# EAGLE schematic MaTouch Lite ESP32-S3 SPI TFT with Touch 3.95'' ST7796 v1.0 (EAGLE 6.1)
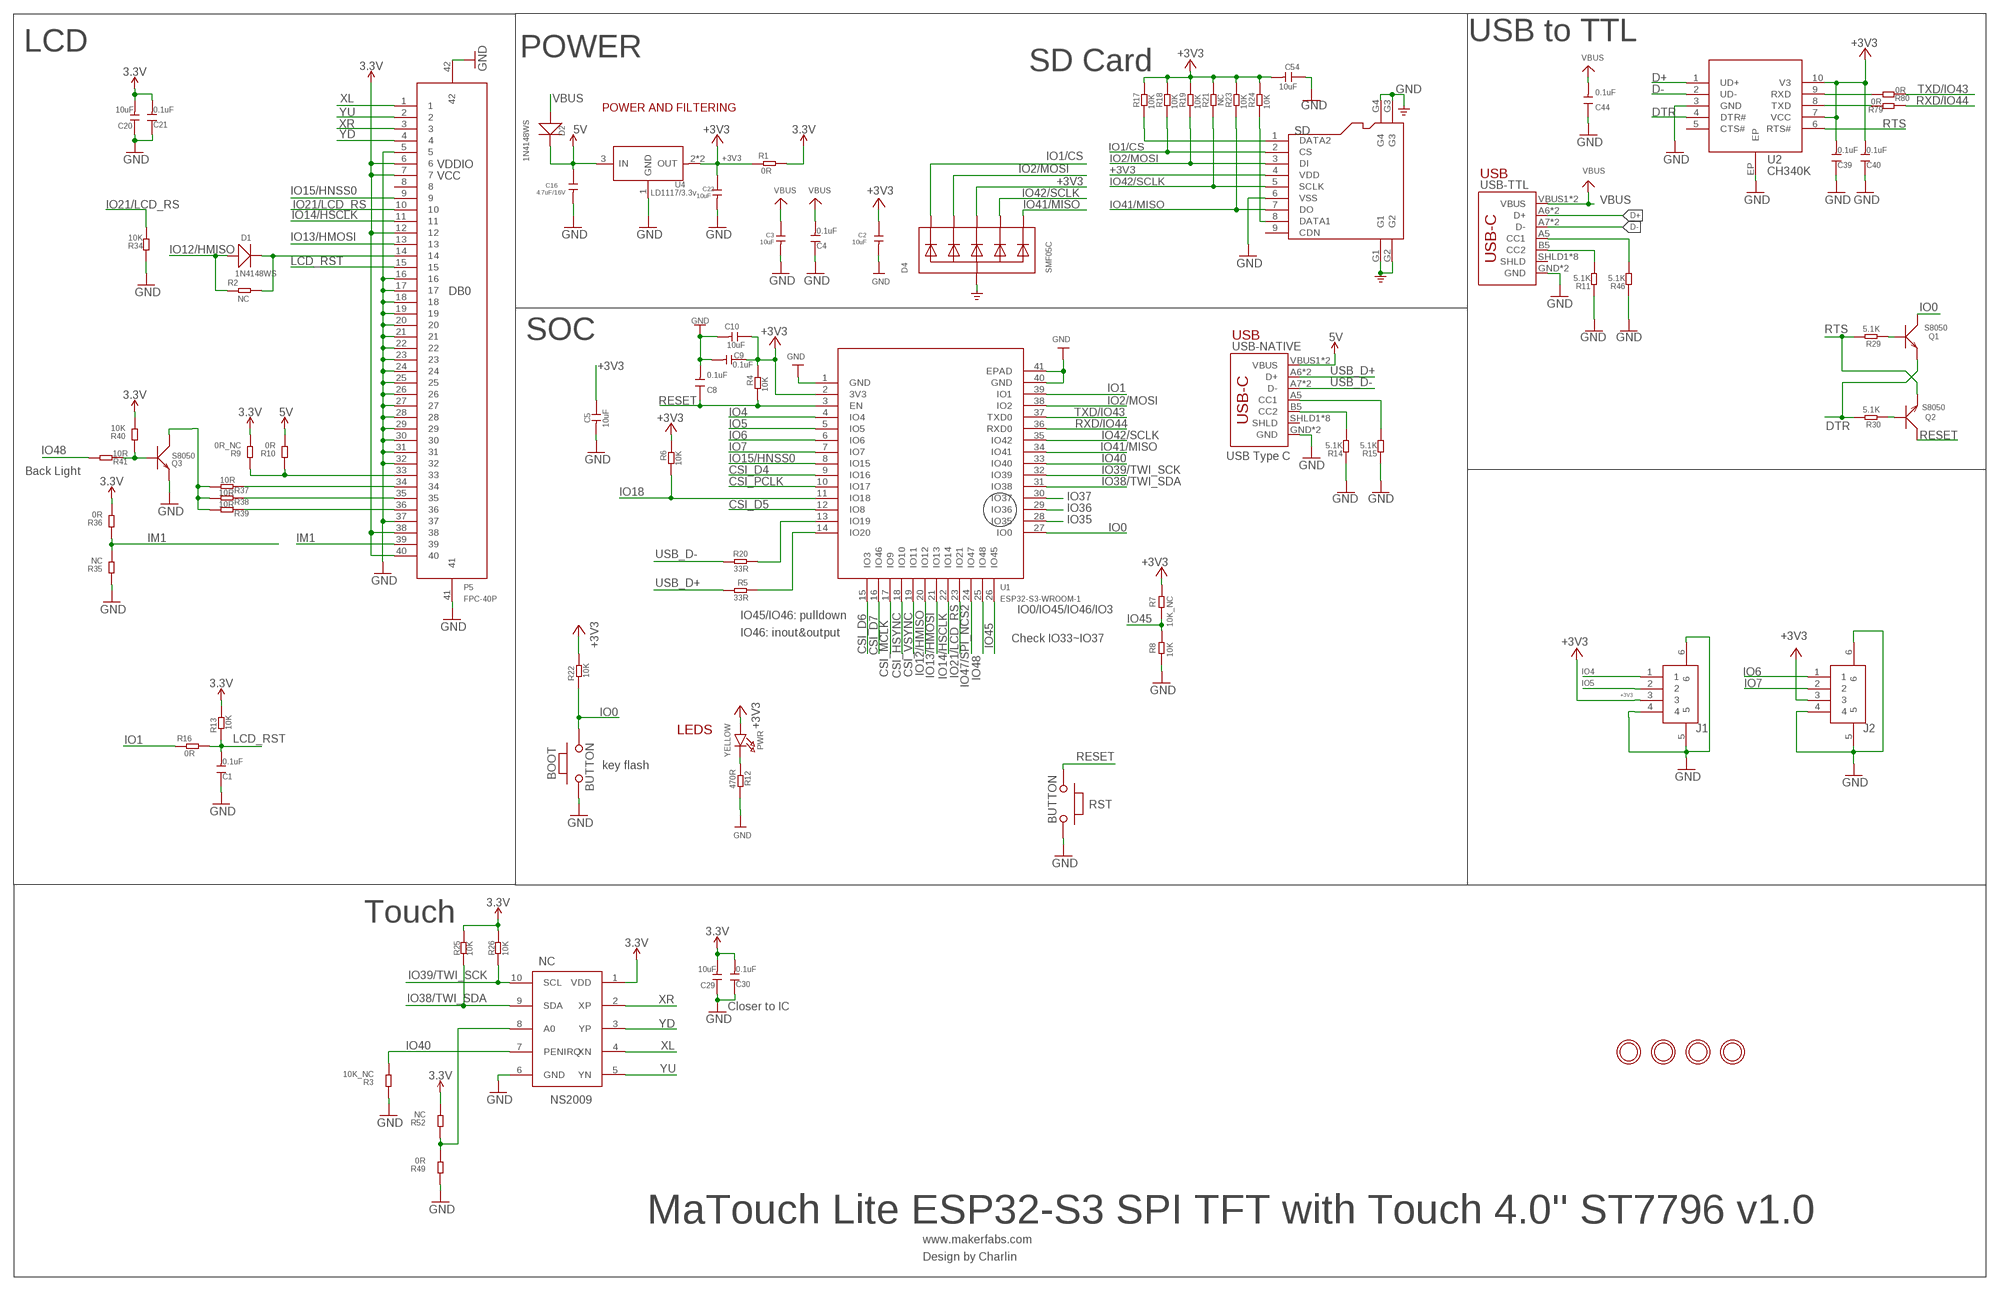
[diagram p0: schematic, sheet 1]

## Parts
BOOT  BUTTON  PB157  [157SW]
C1  0.1uF  DISCRETE_C-0603  [DISCRETE_C0603]
C2  10uF  C-0603  [0603]
C3  10uF  C-0603  [0603]
C4  0.1uF  DISCRETE_C-0603  [DISCRETE_C0603]
C5  10uF  DISCRETE_C-0603  [DISCRETE_C0603]
C8  0.1uF  DISCRETE_C-0603  [DISCRETE_C0603]
C9  0.1uF  DISCRETE_C-0603  [DISCRETE_C0603]
C10  10uF  DISCRETE_C-0603  [DISCRETE_C0603]
C16  4.7uF/16V  C-0603  [0603]
C20  10uF  DISCRETE_C-0603  [DISCRETE_C0603]
C21  0.1uF  DISCRETE_C-0603  [DISCRETE_C0603]
C22  10uF  C-0603  [0603]
C29  10uF  DISCRETE_C-0603  [DISCRETE_C0603]
C30  0.1uF  DISCRETE_C-0603  [DISCRETE_C0603]
C39  0.1uF  DISCRETE_C-0603  [DISCRETE_C0603]
C40  0.1uF  DISCRETE_C-0603  [DISCRETE_C0603]
C44  0.1uF  DISCRETE_C-0603  [DISCRETE_C0603]
C54  10uF  DISCRETE_C-0603  [DISCRETE_C0603]
D1  1N4148WS  D'0805'  [SOD323]
D2  1N4148WS  D'0805'  [SOD323]
D4  SMF05C  TVSARRAY_5LANE  [SOT363]
H1  MICROBUILDER_MOUNTINGHOLE3.0THIN  [MICROBUILDER_MOUNTINGHOLE_3.0_PLATEDTHIN]
H2  MICROBUILDER_MOUNTINGHOLE3.0THIN  [MICROBUILDER_MOUNTINGHOLE_3.0_PLATEDTHIN]
H3  MICROBUILDER_MOUNTINGHOLE3.0THIN  [MICROBUILDER_MOUNTINGHOLE_3.0_PLATEDTHIN]
H4  MICROBUILDER_MOUNTINGHOLE3.0THIN  [MICROBUILDER_MOUNTINGHOLE_3.0_PLATEDTHIN]
J1  CON4-1.25P-SMD  [SMD4-125P-1000L525W350H]
J2  CON4-1.25P-SMD  [SMD4-125P-1000L525W350H]
P5  FPC-40P  [SMD42-50P-2560L490W]
PWR  YELLOW  LED0805_NOOUTLINE  [CHIPLED_0805_NOOUTLINE]
Q1  S8050  TRANSISTOR-NPN-SOT23  [SOT23]
Q2  S8050  TRANSISTOR-NPN-SOT23  [SOT23]
Q3  S8050  TRANSISTOR-NPN-SOT23  [SOT23]
R1  0R  R-0603  [R0603]
R2  NC  R-0603  [R0603]
R3  10K_NC  DISCRETE_R-0603  [DISCRETE_R0603]
R4  10K  R-0603  [R0603]
R5  33R  R-0603  [R0603]
R6  10K  R-0603  [R0603]
R7  10K_NC  R-0603  [R0603]
R8  10K  R-0603  [R0603]
R9  0R_NC  DISCRETE_R-0603  [DISCRETE_R0603]
R10  0R  DISCRETE_R-0603  [DISCRETE_R0603]
R11  5.1K  DISCRETE_R-0603  [DISCRETE_R0603]
R12  470R  R-0603  [R0603]
R13  10K  R-0603  [R0603]
R14  5.1K  DISCRETE_R-0603  [DISCRETE_R0603]
R15  5.1K  DISCRETE_R-0603  [DISCRETE_R0603]
R16  0R  R-0603  [R0603]
R17  10K  R-0603  [R0603]
R18  10K  R-0603  [R0603]
R19  10K  R-0603  [R0603]
R20  33R  R-0603  [R0603]
R21  NC  R-0603  [R0603]
R22  10K  R-0603  [R0603]
R23  10K  R-0603  [R0603]
R24  10K  R-0603  [R0603]
R25  10K  R-0603  [R0603]
R26  10K  R-0603  [R0603]
R29  5.1K  R-0603  [R0603]
R30  5.1K  R-0603  [R0603]
R34  10K  DISCRETE_R-0603  [DISCRETE_R0603]
R35  NC  DISCRETE_R-0603  [DISCRETE_R0603]
R36  0R  DISCRETE_R-0603  [DISCRETE_R0603]
R37  10R  DISCRETE_R-0603  [DISCRETE_R0603]
R38  10R  DISCRETE_R-0603  [DISCRETE_R0603]
R39  10R  DISCRETE_R-0603  [DISCRETE_R0603]
R40  10K  DISCRETE_R-0603  [DISCRETE_R0603]
R41  10R  DISCRETE_R-0603  [DISCRETE_R0603]
R46  5.1K  DISCRETE_R-0603  [DISCRETE_R0603]
R49  0R  DISCRETE_R-0603  [DISCRETE_R0603]
R52  NC  DISCRETE_R-0603  [DISCRETE_R0603]
R79  0R  R-0603  [R0603]
R80  0R  R-0603  [R0603]
RST  BUTTON  PB157  [157SW]
SD  HOLDER-MICROSD-9P  [9P-SMD-W/-RING]
U1  ESP32-S3-WROOM-1  [ESP32-S3-WROOM-1]
U2  CH340K  [ESOP-10-EP-150MIL]
U4  LD1117/3.3v  LD1117'SOT89'  [SOT89]
U8  NS2009  [MSOP10]
USB-NATIVE  USB_C5  [USB-C-16P-5]
USB-TTL  USB_C5  [USB-C-16P-5]

## Nets
5V: C16.1 D2.- R10.2 U4.3(IN) USB-NATIVE.VBUS1(VBUS) USB-NATIVE.VBUS2(VBUS)
+3V3: C2.1 C5.1 C9.1 C10.1 C20.2 C21.2 C22.1 C29.2 C30.2 C39.2 C40.2 C54.2 D4.4(C3) J1.3 J2.3 P5.6 P5.7 P5.12 P5.38 P5.40 PWR.A R1.1 R1.2 R4.2 R6.2 R7.2 R9.2 R13.2 R17.2 R18.2 R19.2 R21.2 R22.2 R23.2 R24.2 R25.2 R26.2 R36.2 R40.2 R52.2 SD.4(VDD) U1.2(3V3) U2.7(VCC) U2.10(V3) U4.2(OUT) U4.4(OUT) U8.1(VDD) ; supply symbol labelled 3.3V
CSI_D4: U1.9(IO16)
CSI_D5: U1.12(IO8)
CSI_D6: U1.15(IO3)
CSI_D7: U1.16(IO46)
CSI_HSYNC: U1.18(IO10)
CSI_MCLK: U1.17(IO9)
CSI_PCLK: U1.10(IO17)
CSI_VSYNC: U1.19(IO11)
D+: U2.1(UD+) USB-TTL.A6(D+) USB-TTL.B6(D+)
D-: U2.2(UD-) USB-TTL.A7(D-) USB-TTL.B7(D-)
DTR: Q1.2(E) R30.2 U2.4(DTR#)
GND: BOOT.1 C1.1 C2.2 C3.2 C4.1 C5.2 C8.2 C9.2 C10.2 C16.2 C20.1 C21.1 C22.2 C29.1 C30.1 C39.1 C40.1 C44.1 C54.1 D4.2(A) J1.4 J1.5 J1.6 J2.4 J2.5 J2.6 P5.5 P5.16 P5.17 P5.18 P5.19 P5.20 P5.21 P5.22 P5.23 P5.24 P5.25 P5.26 P5.27 P5.28 P5.29 P5.30 P5.31 P5.32 P5.37 P5.41 P5.42 Q3.2(E) R3.1 R8.1 R11.1 R12.2 R14.1 R15.1 R34.1 R35.1 R46.1 R49.1 RST.1 SD.6(VSS) SD.G1 SD.G2 SD.G3 SD.G4 U1.1(GND) U1.40(GND) U1.41(EPAD) U2.3(GND) U2.EP U4.1(GND) U8.6(GND) USB-NATIVE.GND USB-NATIVE.GND2(GND) USB-TTL.GND USB-TTL.GND2(GND)
IM1: P5.39 R35.2 R36.1
IO0: BOOT.2 Q1.3(C) R22.1 U1.27(IO0)
IO1: R16.1 U1.39(IO1)
IO1/CS: D4.1(C1) R18.1 SD.2(CS)
IO2/MOSI: D4.3(C2) R19.1 SD.3(DI) U1.38(IO2)
IO4: J1.1 U1.4(IO4)
IO5: J1.2 U1.5(IO5)
IO6: J2.1 U1.6(IO6)
IO7: J2.2 U1.7(IO7)
IO12/HMISO: D1.+ R2.1 U1.20(IO12)
IO13/HMOSI: P5.13 U1.21(IO13)
IO14/HSCLK: P5.11 U1.22(IO14)
IO15/HNSS0: P5.9 U1.8(IO15)
IO18: R6.1 U1.11(IO18)
IO21/LCD_RS: P5.10 R34.2 U1.23(IO21)
IO35: U1.28(IO35)
IO36: U1.29(IO36)
IO37: U1.30(IO37)
IO38/TWI_SDA: R25.1 U1.31(IO38) U8.9(SDA)
IO39/TWI_SCK: R26.1 U1.32(IO39) U8.10(SCL)
IO40: R3.2 U1.33(IO40) U8.7(PENIRQ)
IO41/MISO: D4.6(C5) R23.1 SD.7(DO) U1.34(IO41)
IO42/SCLK: D4.5(C4) R21.1 SD.5(SCLK) U1.35(IO42)
IO45: R7.1 R8.2 U1.26(IO45)
IO47/SPI_NCS2: U1.24(IO47)
IO48: R41.2 U1.25(IO48)
LCD_RST: C1.2 P5.15 R13.1 R16.2
N$1: R46.2 USB-TTL.A5(CC1)
N$4: D1.- P5.14 R2.2
N$5: Q2.1(B) R30.1
N$7: PWR.C R12.1
N$8: Q1.1(B) R29.1
N$14: R15.2 USB-NATIVE.A5(CC1)
N$15: R20.2 U1.13(IO19)
N$16: R5.2 U1.14(IO20)
N$17: R14.2 USB-NATIVE.B5(CC2)
N$18: R11.2 USB-TTL.B5(CC2)
N$20: P5.34 R37.1
N$21: P5.35 R38.1
N$22: P5.36 R39.1
N$23: Q3.1(B) R40.1 R41.1
N$24: Q3.3(C) R37.2 R38.2 R39.2
N$25: R49.2 R52.1 U8.8(A0)
N$26: P5.33 R9.1 R10.1
N$36: R80.2 U2.9(RXD)
N$37: R79.2 U2.8(TXD)
N$47: R17.1 SD.1(DATA2)
N$48: R24.1 SD.8(DATA1)
RESET: C8.1 Q2.3(C) R4.1 RST.2 U1.3(EN)
RTS: Q2.2(E) R29.2 U2.6(RTS#)
RXD/IO44: R79.1 U1.36(RXD0)
TXD/IO43: R80.1 U1.37(TXD0)
USB_D+: R5.1 USB-NATIVE.A6(D+) USB-NATIVE.B6(D+)
USB_D-: R20.1 USB-NATIVE.A7(D-) USB-NATIVE.B7(D-)
VBUS: C3.1 C4.2 C44.2 D2.+ USB-TTL.VBUS1(VBUS) USB-TTL.VBUS2(VBUS)
XL: P5.1 U8.4(XN)
XR: P5.3 U8.2(XP)
YD: P5.4 U8.3(YP)
YU: P5.2 U8.5(YN)
Unconnected: P5.8 SD.9(CDN) U2.5(CTS#) USB-NATIVE.SHLD1(SHLD) USB-NATIVE.SHLD2(SHLD) USB-NATIVE.SHLD3(SHLD) USB-NATIVE.SHLD4(SHLD) USB-NATIVE.SHLD5(SHLD) USB-NATIVE.SHLD6(SHLD) USB-NATIVE.SHLD7(SHLD) USB-NATIVE.SHLD8(SHLD) USB-TTL.SHLD1(SHLD) USB-TTL.SHLD2(SHLD) USB-TTL.SHLD3(SHLD) USB-TTL.SHLD4(SHLD) USB-TTL.SHLD5(SHLD) USB-TTL.SHLD6(SHLD) USB-TTL.SHLD7(SHLD) USB-TTL.SHLD8(SHLD)

## Notes on the sheet
- USB to TTL
- LCD | POWER
- SD Card
- POWER AND FILTERING
- VDDIO
- VCC | USB
- DB0
- SOC | USB
- USB Type C
- Back Light
- IO0/IO45/IO46/IO3
- IO45/IO46: pulldown
- IO46: inout&output
- Check IO33~IO37
- LEDS
- key flash
- Touch
- NC
- Closer to IC
- NS2009
- MaTouch Lite ESP32-S3 SPI TFT with Touch 4.0'' ST7796 v1.0
- www.makerfabs.com
- Design by Charlin

## Library data of the parts
BOOT RST = MySMD:PB157
C1 C4 C5 C8-C10 C20 C21 C29 C30 C39 C40 C44 C54 = A9G:DISCRETE_C*: Ceramic Capacitors
C2 C3 C16 C22 = Discrete:C*: Ceramic Capacitors
D1 D2 = Discrete:D*
D4 = microbuilder:TVSARRAY_5LANE: Voltage Transient Suppressor Array SOT363 SMF05C - 100W 5V: Digikey - SMF05CT1GOSCT-ND
H1-H4 = Adafruit UDA1334 I2S DAC:MICROBUILDER_MOUNTINGHOLE: Mounting Hole For #2 screws (0.086"/2.18mm width, 0.094"/2.4mm hole) use 2.5mm; BOM: EXCLUDE
J1 J2 = user:CON4-1.25P-SMD
P5 = self:FPC-40P
PWR = microbuilder:LED: LED 0603 - 0603 Surface Mount Package 2mA: Green LED - Low Power (3.9mcd, 2ma, 1.7Vf) - Digikey: 475-2709-2-ND Orange LED - Low Power (9.8mcd, 2ma, 1.8Vf) - Digikey: 475-1194-2-ND Red LED - Low Power (5mcd, 2ma, 1.8Vf) - Digikey: 475-1195-2-ND Yellow LED - Low Power (7mcd, 2ma, 1.8Vf) - Digikey: 475-1196-2-ND 5mA: Blue LED - Low Power (17mcd, 5ma, 2.9Vf) - Digikey: LNJ937W8CRACT-ND 0805 - 0805 Surface Mount Package 2mA: Red LED (8.8mcd, 2mA, 1.8Vf, Clear) - Low Power [Digikey: 475-2510-1-ND] Green LED (5mcd, 2mA, 1.8Vf, Clear) - Low Power [Digikey: 475-2730-1-ND] Yellow LED (11.3mcd, 2mA, 1.8Vf, Clear) - Low Power [Digikey: 475-2555-1-ND] 20mA: Red LED (104mcd, 20mA, Diffused) - LS R976 [Digikey: 475-1278-6-ND] Red LED (12mcd, 20mA, 2.0Vf, Clear) - APT2012EC [Digikey: 754-1128-1-ND] Green LED (15mcd, 20mA, 2.2Vf, Clear) - APT2012GC [Digikey: 754-1131-1-ND] Orange LED (160mcd, 20mA, 2.1Vf, Clear) - APT2012SECK [Digikey: 754-1130-1-ND] 1206 - 1206 Surface Mount Package Green LED (26mcd, 20mA, Diffused) - LG N971 [Digikey: 475-1407-6-ND] Red LED (15mcd, 20mA, Diffused) - LH N974 [Digikey: 475-1416-6-ND] Cree - Cree High-Power Surface Mount LEDs XPEBWT-L1-0000-00D50 - White 111lm 350mA 2.9Vf 6200K 110° XTEAWT-00-0000-00000LEE3 - White 114lm 350mA 2.85Vf 5000K 115° Everlight - Everlight 45-21 Series Surface Mount LEDs 45-21/QK2C-B2832AC2CB2/2T - Warm White 2000mcd 20mA 3.25Vf 3050K 120° 45-21/LK2C-B38452C4CB2/2T - Nuetral White 2000mcd 20mA 3.25Vf 4150K 120° 45-21/LK2C-B50634C6CB2/2T - Cold White 2200mcd 20mA 3.25Vf 5650K 120° PLCC2 Reverse Mount LS T77K-J1L2-1-0-2-R18-Z - Red 11.25mcd 2mA 1.8Vf 630nm 120° LO T77K-L1M2-24-Z - Orange 19.6mcd 2mA 1.8Vf 606nm 120° LY T77K-K2M1-26-Z - Yellow 15.7mcd 2mA 1.8Vf 587nm 120°
Q1-Q3 = Discrete:TRANSISTOR-NPN*: NPN audion
R1 R2 R4-R8 R12 R13 R16-R26 R29 R30 R79 R80 = Discrete:R*
R3 R9-R11 R14 R15 R34-R41 R46 R49 R52 = A9G:DISCRETE_R*
SD = Connector:HOLDER-MICROSD-9P
U1 = self:ESP32-S3-WROOM-1
U2 = sale:CH340K
U4 = IC:LD1117: Low Drop Fixed And Adjustable Positive Voltage Regulators http://www.datasheetcatalog.org/datasheet/SGSThomsonMicroelectronics/mXuqtqv.pdf
U8 = NS2009:NS2009
USB-NATIVE USB-TTL = USBC:USB_C: USB Type C 16Pin Connector Super Speed pins not available on the 16-pin purely SMD connector so this part is best for USB 2.0 implementations. D1 and D2 are tied together enabling D+/- no matter which way the cable is plugged into the connector. The two channel configuration pins (CC1/2) are exposed. These are normally connected to ground via 5.1k resistors but can be reconfigured for high current/high power applications.

## Net classes
0 default: width 0.203 mm, drill 0.305 mm, clearance 0.152 mm
1 vbat: width 0.254 mm, drill 0.305 mm, clearance 0.152 mm